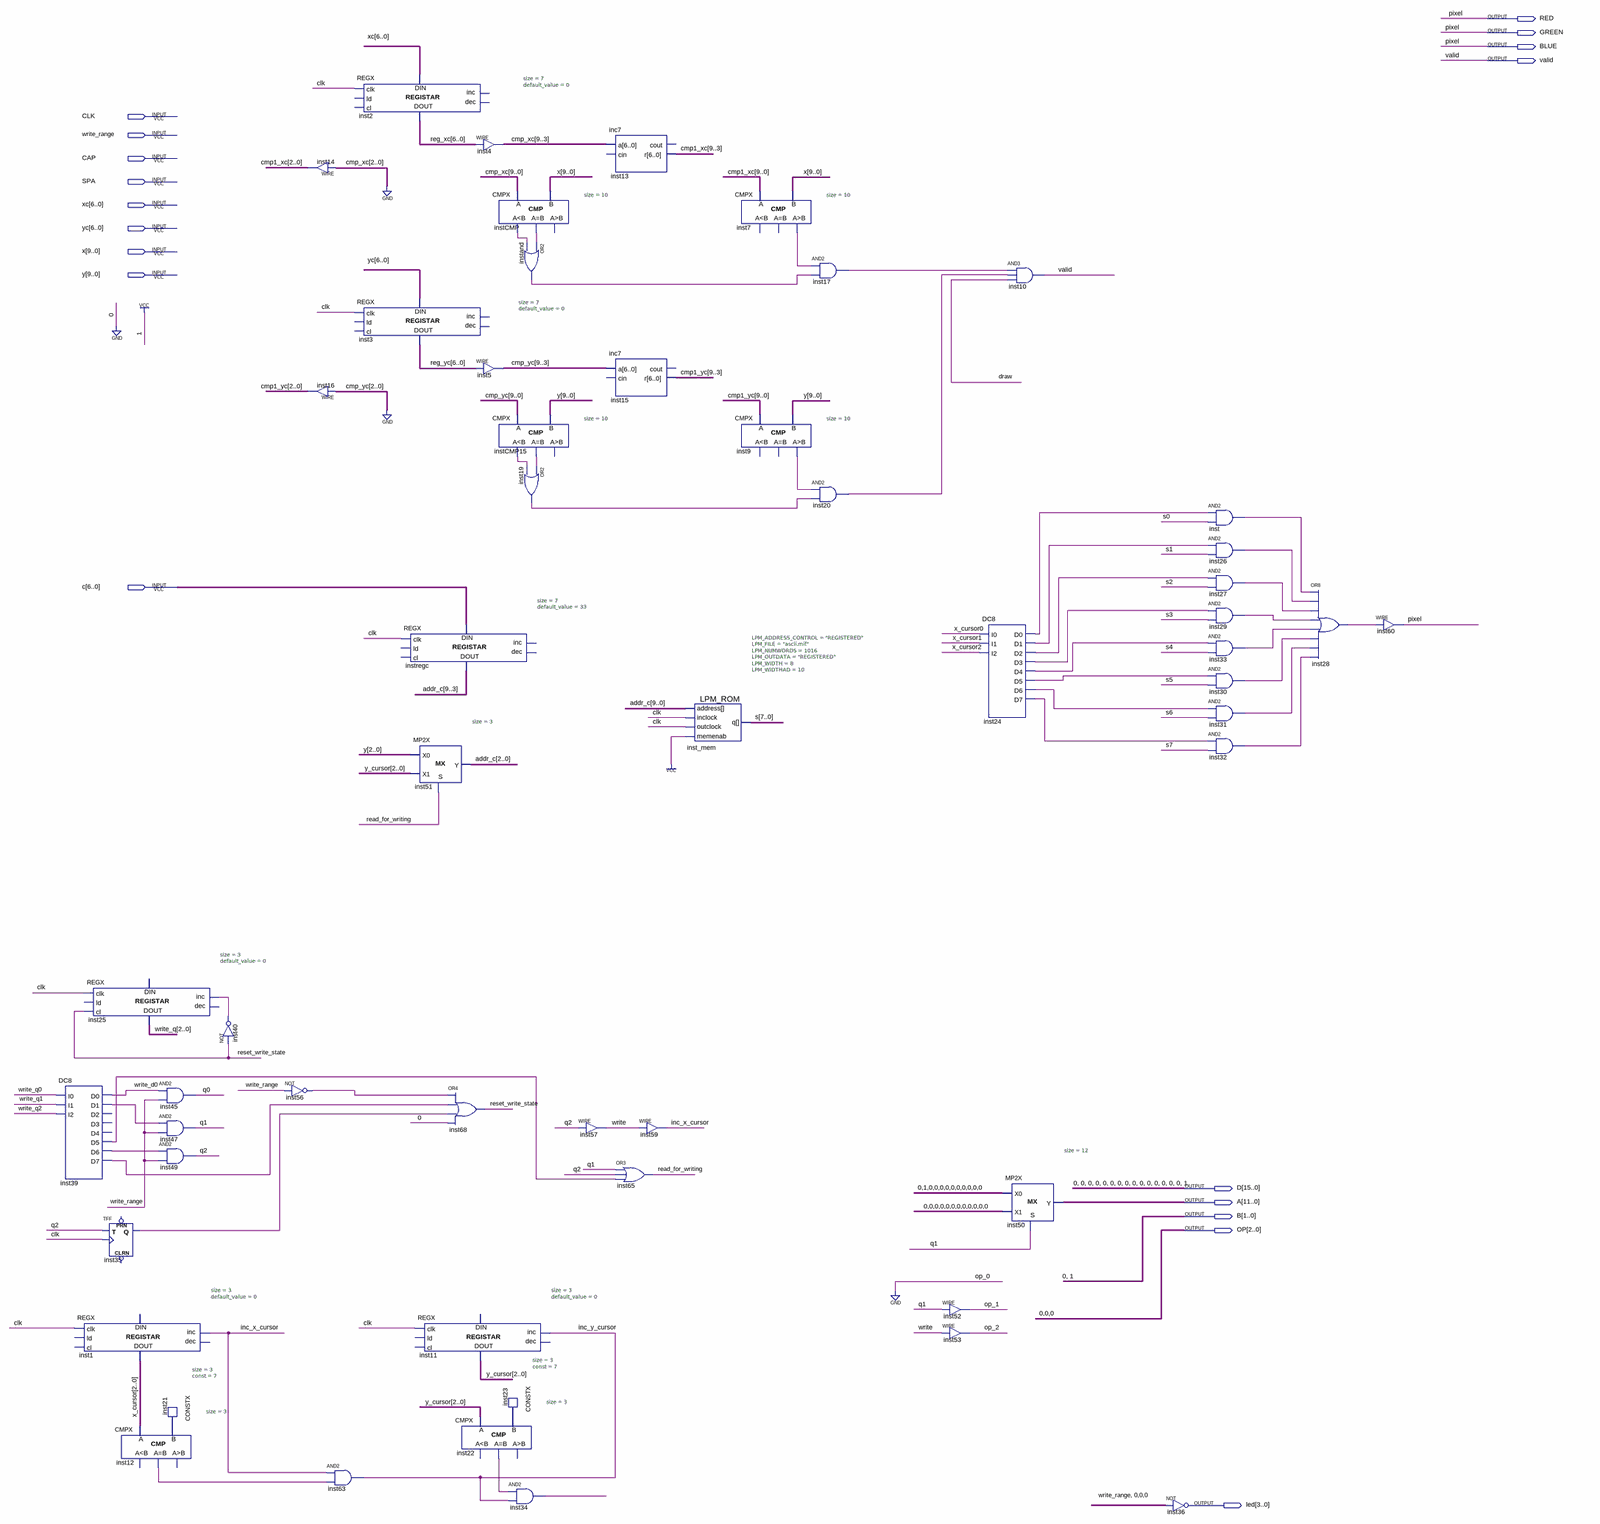
[diagram p0: schematic sheet, whole]
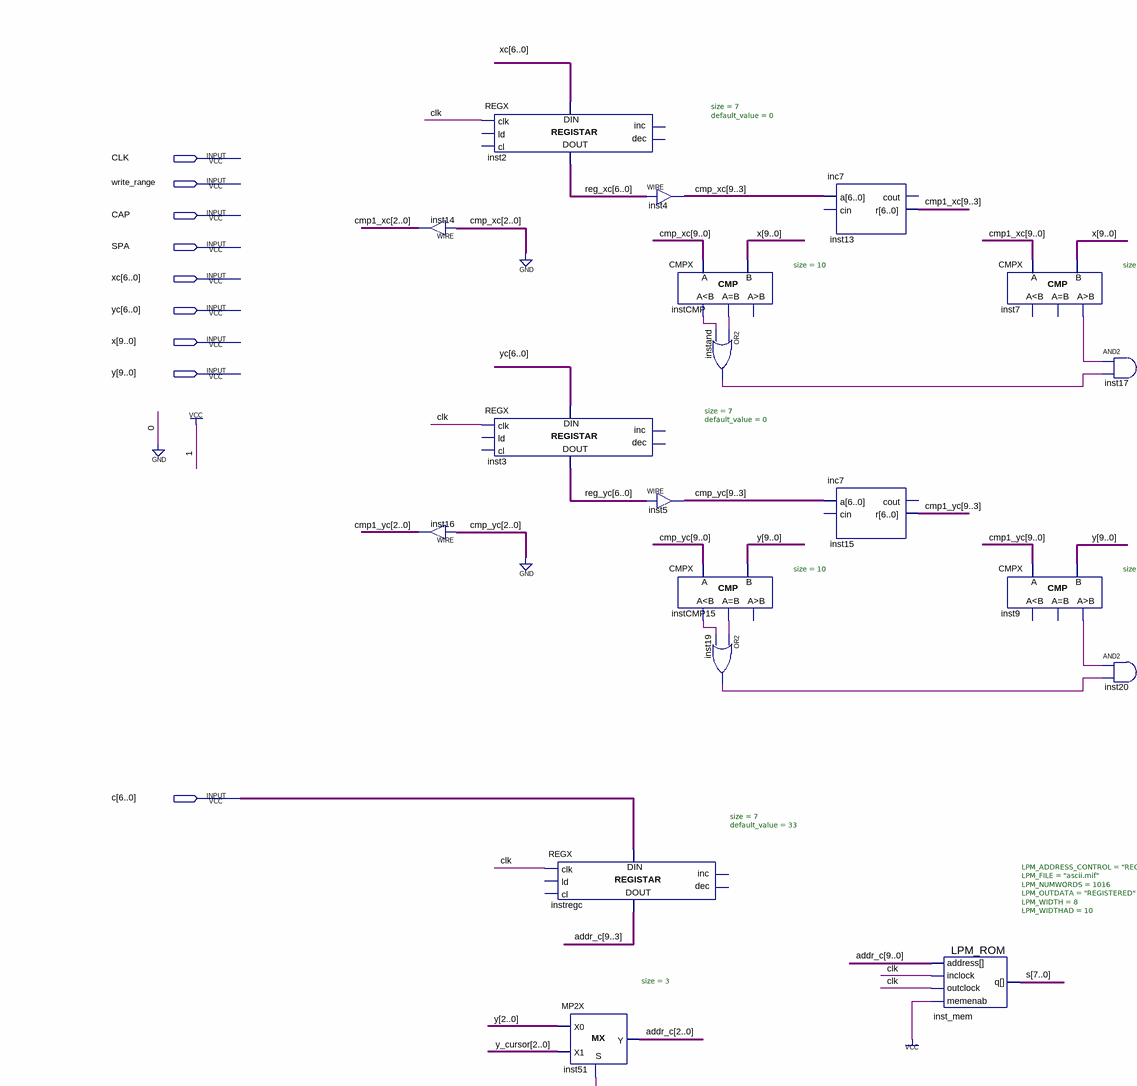
[diagram p1: schematic sheet, upper left part]
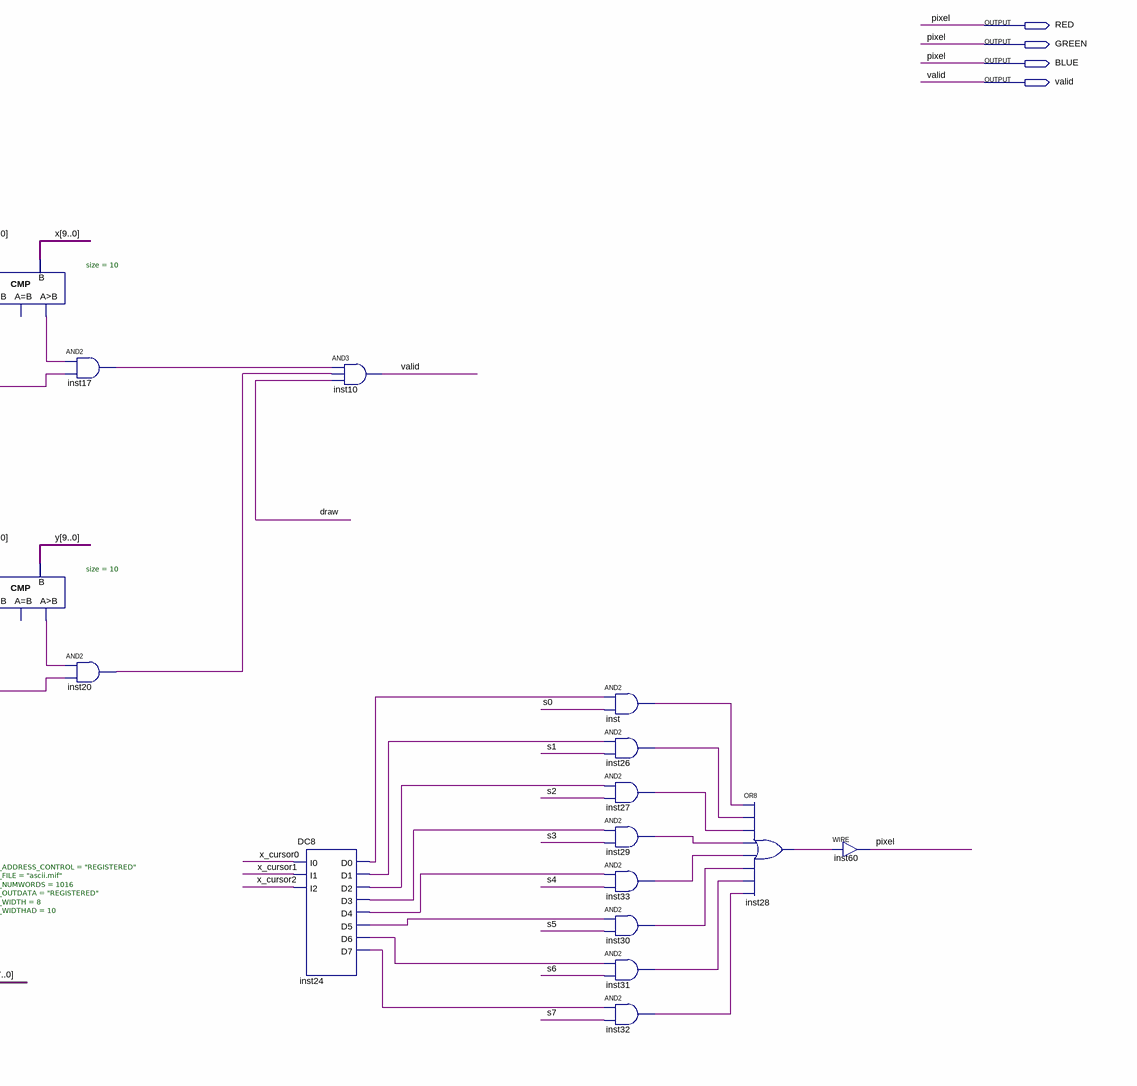
[diagram p2: schematic sheet, upper right part]
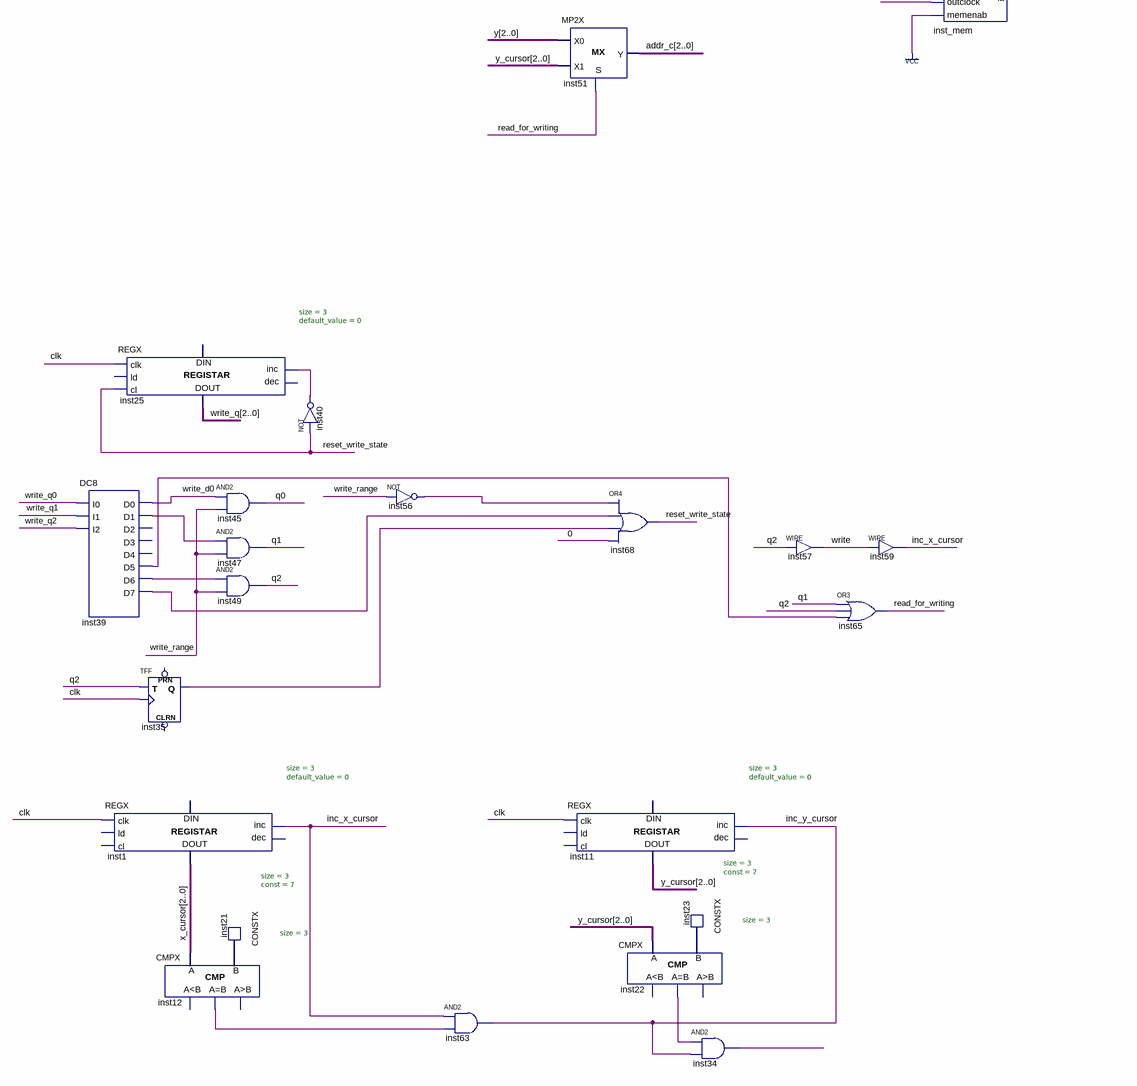
[diagram p3: schematic sheet, lower left part]
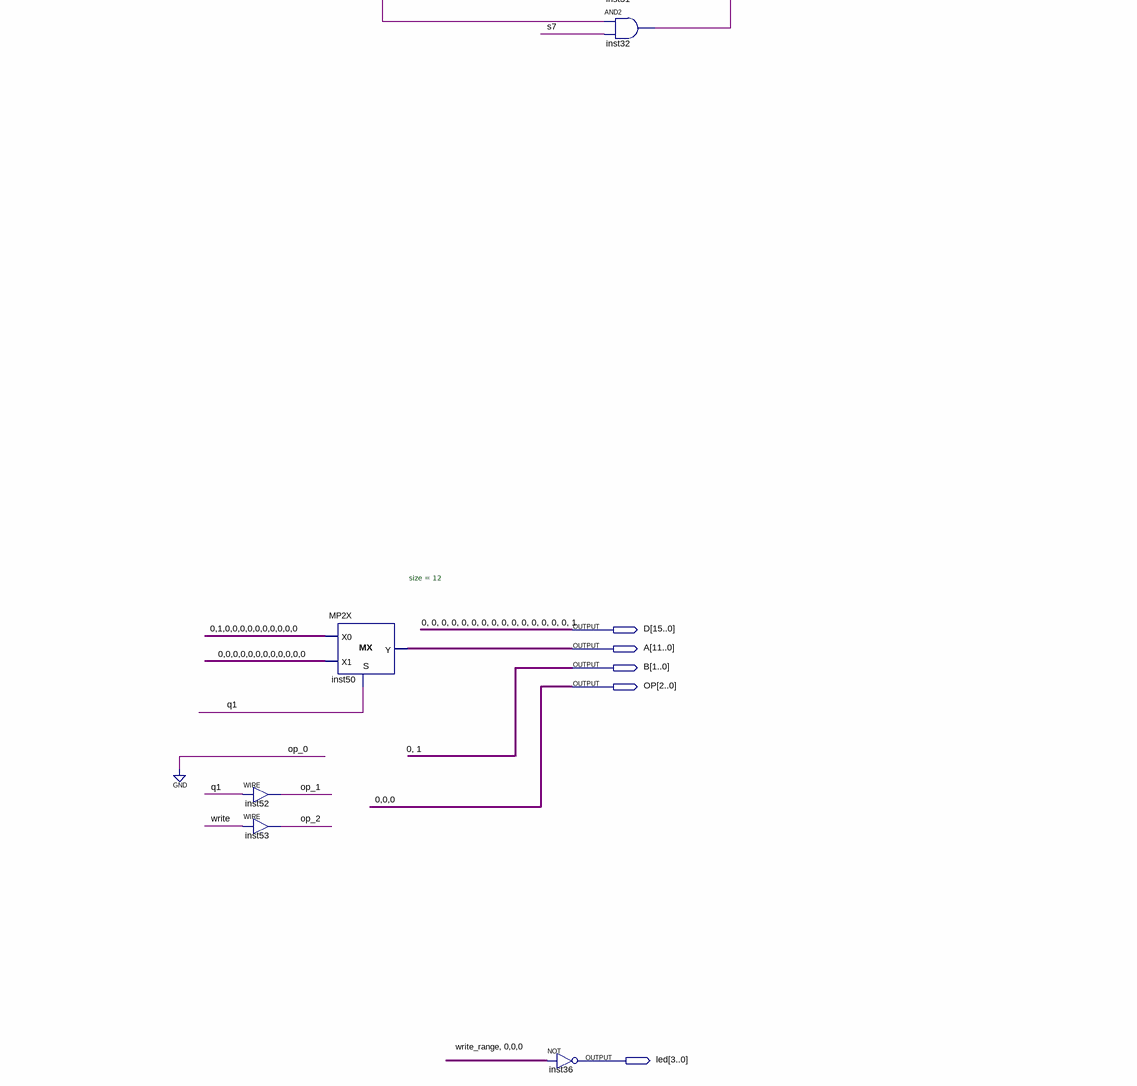
[diagram p4: schematic sheet, lower right part]
// Quartus schematic Layer1.bdf as structural Verilog: 55 symbols, 18 pins
module Layer1 (
  input  CLK,
  input  write_range,
  input  CAP,
  input  SPA,
  input  [6:0] xc,
  input  [6:0] yc,
  input  [9:0] x,
  input  [9:0] y,
  input  [6:0] c,
  output RED,
  output GREEN,
  output BLUE,
  output valid,
  output [15:0] D,
  output [11:0] A,
  output [1:0] B,
  output [2:0] OP,
  output [3:0] led
);

  wire draw, inc_x_cursor, inc_y_cursor, inst7_gr, inst9_gr, inst12_eq, inst17_out, inst19_out, inst20_out,
       inst22_eq, inst24_d0, inst24_d1, inst24_d2, inst24_d3, inst24_d4, inst24_d5, inst24_d6, inst24_d7,
       inst26_out, inst27_out, inst28_out, inst29_out, inst30_out, inst31_out, inst32_out, inst33_out,
       inst34_out, inst35_q, inst39_d1, inst39_d5, inst39_d6, inst39_d7, inst40_out, inst56_out, inst_out,
       instand_out, instCMP15_eq, instCMP15_ls, instCMP_eq, instCMP_ls, op_1, op_2, q0, q1, q2,
       read_for_writing, reset_write_state, write, write_d0;
  wire [2:0] inst21_data, inst23_data, write_q, x_cursor, y_cursor;
  wire [6:0] reg_xc, reg_yc;
  wire [7:0] s;
  wire [9:0] addr_c, cmp1_xc, cmp1_yc;
  wire [9:3] cmp_xc, cmp_yc;

  DC8 inst39 (
    .I0(write_q[0]), .I1(write_q[1]), .I2(write_q[2]), .D0(write_d0), .D1(inst39_d1), .D5(inst39_d5),
    .D6(inst39_d6), .D7(inst39_d7));  // open: D2, D3, D4
  REGX #(.size(3), .default_value(0)) inst1 (
    .clk(CLK), .inc(inc_x_cursor), .data_out(x_cursor));  // open: ld, cl, dec, data_in
  REGX #(.size(3), .default_value(0)) inst25 (
    .clk(CLK), .cl(reset_write_state), .inc(inst40_out), .data_out(write_q));  // open: ld, dec, data_in
  TFF inst35 (.T(q2), .CLK(CLK), .Q(inst35_q));  // open: PRN, CLRN
  CMPX #(.size(3)) inst12 (.A(x_cursor), .B(inst21_data), .eq(inst12_eq));  // open: ls, gr
  and inst45 (q0, write_d0, write_range);
  and inst47 (q1, inst39_d1, write_range);
  and inst49 (q2, inst39_d6, write_range);
  CONSTX #(.size(3), .\const (7)) inst21 (.data(inst21_data));
  not inst40 (inst40_out, reset_write_state);
  not inst56 (inst56_out, write_range);
  assign cmp1_xc[2:0] = 3'b000;  // WIRE inst14
  assign cmp1_yc[2:0] = 3'b000;  // WIRE inst16
  and inst63 (inc_y_cursor, inc_x_cursor, inst12_eq);
  REGX #(.size(7), .default_value(0)) inst2 (.clk(CLK), .data_in(xc), .data_out(reg_xc));  // open: ld, cl, inc, dec
  REGX #(.size(7), .default_value(0)) inst3 (.clk(CLK), .data_in(yc), .data_out(reg_yc));  // open: ld, cl, inc, dec
  REGX #(.size(7), .default_value(33)) instregc (
    .clk(CLK), .data_in(c), .data_out(addr_c[9:3]));  // open: ld, cl, inc, dec
  MP2X #(.size(3)) inst51 (.S(read_for_writing), .X0(y[2:0]), .X1(y_cursor), .Y(addr_c[2:0]));
  REGX #(.size(3), .default_value(0)) inst11 (
    .clk(CLK), .inc(inc_y_cursor), .data_out(y_cursor));  // open: ld, cl, dec, data_in
  or inst68 (reset_write_state, inst56_out, inst39_d7, inst35_q, 1'b0);
  CMPX #(.size(3)) inst22 (.A(y_cursor), .B(inst23_data), .eq(inst22_eq));  // open: ls, gr
  assign cmp_xc = reg_xc;  // WIRE inst4
  CMPX #(.size(10)) instCMP (.A({cmp_xc, 3'b000}), .B(x), .ls(instCMP_ls), .eq(instCMP_eq));  // open: gr
  assign cmp_yc = reg_yc;  // WIRE inst5
  CMPX #(.size(10)) instCMP15 (.A({cmp_yc, 3'b000}), .B(y), .ls(instCMP15_ls), .eq(instCMP15_eq));  // open: gr
  or instand (instand_out, instCMP_eq, instCMP_ls);
  or inst19 (inst19_out, instCMP15_eq, instCMP15_ls);
  CONSTX #(.size(3), .\const (7)) inst23 (.data(inst23_data));
  and inst34 (inst34_out, inst22_eq, inc_y_cursor);
  assign write = q2;  // WIRE inst57
  inc7 inst13 (.a(cmp_xc), .r(cmp1_xc[9:3]));  // open: cin, cout
  inc7 inst15 (.a(cmp_yc), .r(cmp1_yc[9:3]));  // open: cin, cout
  assign inc_x_cursor = write;  // WIRE inst59
  or inst65 (read_for_writing, q1, q2, inst39_d5);
  LPM_ROM #(.LPM_ADDRESS_CONTROL("REGISTERED"), .LPM_FILE("ascii.mif"), .LPM_NUMWORDS(1016), .LPM_OUTDATA("REGISTERED"), .LPM_WIDTH(8), .LPM_WIDTHAD(10)) inst_mem (
    .address(addr_c), .inclock(CLK), .outclock(CLK), .memenab(1'b1), .q(s));
  CMPX #(.size(10)) inst7 (.A(cmp1_xc), .B(x), .gr(inst7_gr));  // open: ls, eq
  CMPX #(.size(10)) inst9 (.A(cmp1_yc), .B(y), .gr(inst9_gr));  // open: ls, eq
  and inst17 (inst17_out, inst7_gr, instand_out);
  and inst20 (inst20_out, inst9_gr, inst19_out);
  assign op_1 = q1;  // WIRE inst52
  assign op_2 = write;  // WIRE inst53
  and inst10 (valid, inst17_out, inst20_out, draw);
  DC8 inst24 (
    .I0(x_cursor[0]), .I1(x_cursor[1]), .I2(x_cursor[2]), .D0(inst24_d0), .D1(inst24_d1), .D2(inst24_d2),
    .D3(inst24_d3), .D4(inst24_d4), .D5(inst24_d5), .D6(inst24_d6), .D7(inst24_d7));
  MP2X #(.size(12)) inst50 (.S(q1), .X0(12'b010000000000), .X1({12{1'b0}}), .Y(A));
  assign led = ~{write_range, 3'b000};  // NOT inst36, 4 bits wide
  and inst (inst_out, inst24_d0, s[0]);
  and inst26 (inst26_out, inst24_d1, s[1]);
  and inst27 (inst27_out, inst24_d2, s[2]);
  and inst29 (inst29_out, inst24_d3, s[3]);
  and inst33 (inst33_out, inst24_d4, s[4]);
  and inst30 (inst30_out, inst24_d5, s[5]);
  and inst31 (inst31_out, inst24_d6, s[6]);
  and inst32 (inst32_out, inst24_d7, s[7]);
  or inst28 (inst28_out, inst_out, inst26_out, inst27_out, inst29_out, inst33_out, inst30_out, inst31_out, inst32_out);
  assign BLUE = inst28_out;  // WIRE inst60

  assign B = 2'b01;
  assign D = 16'b0000000000000001;
  assign GREEN = BLUE;
  assign OP = 3'b000;
  assign RED = BLUE;

  // Other names for the same wires on the sheet: pixel = BLUE
endmodule
